# Altium schematic sheet ETH_PHY.SchDoc
size A2
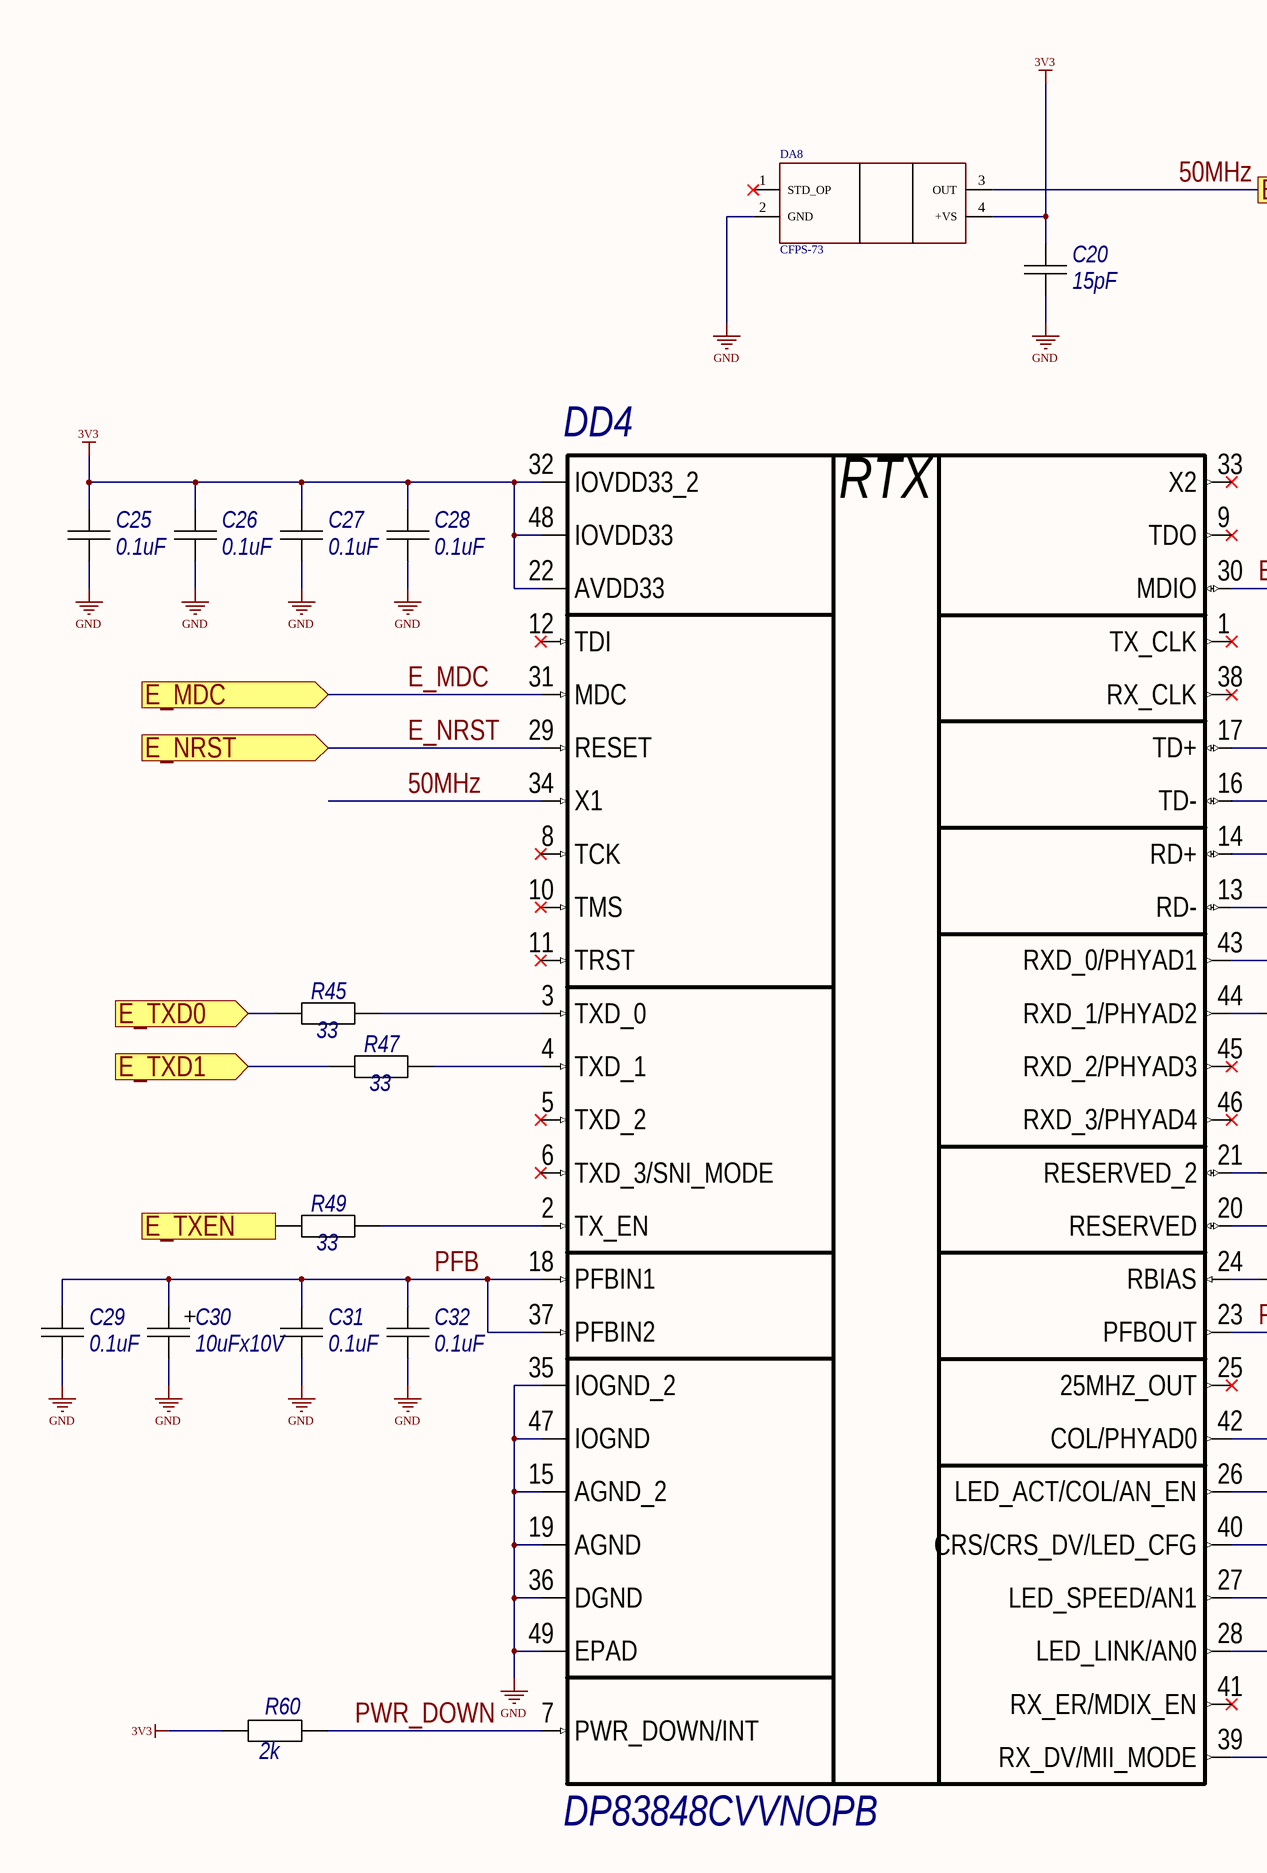
[diagram p0: ETH_PHY.SchDoc, left]
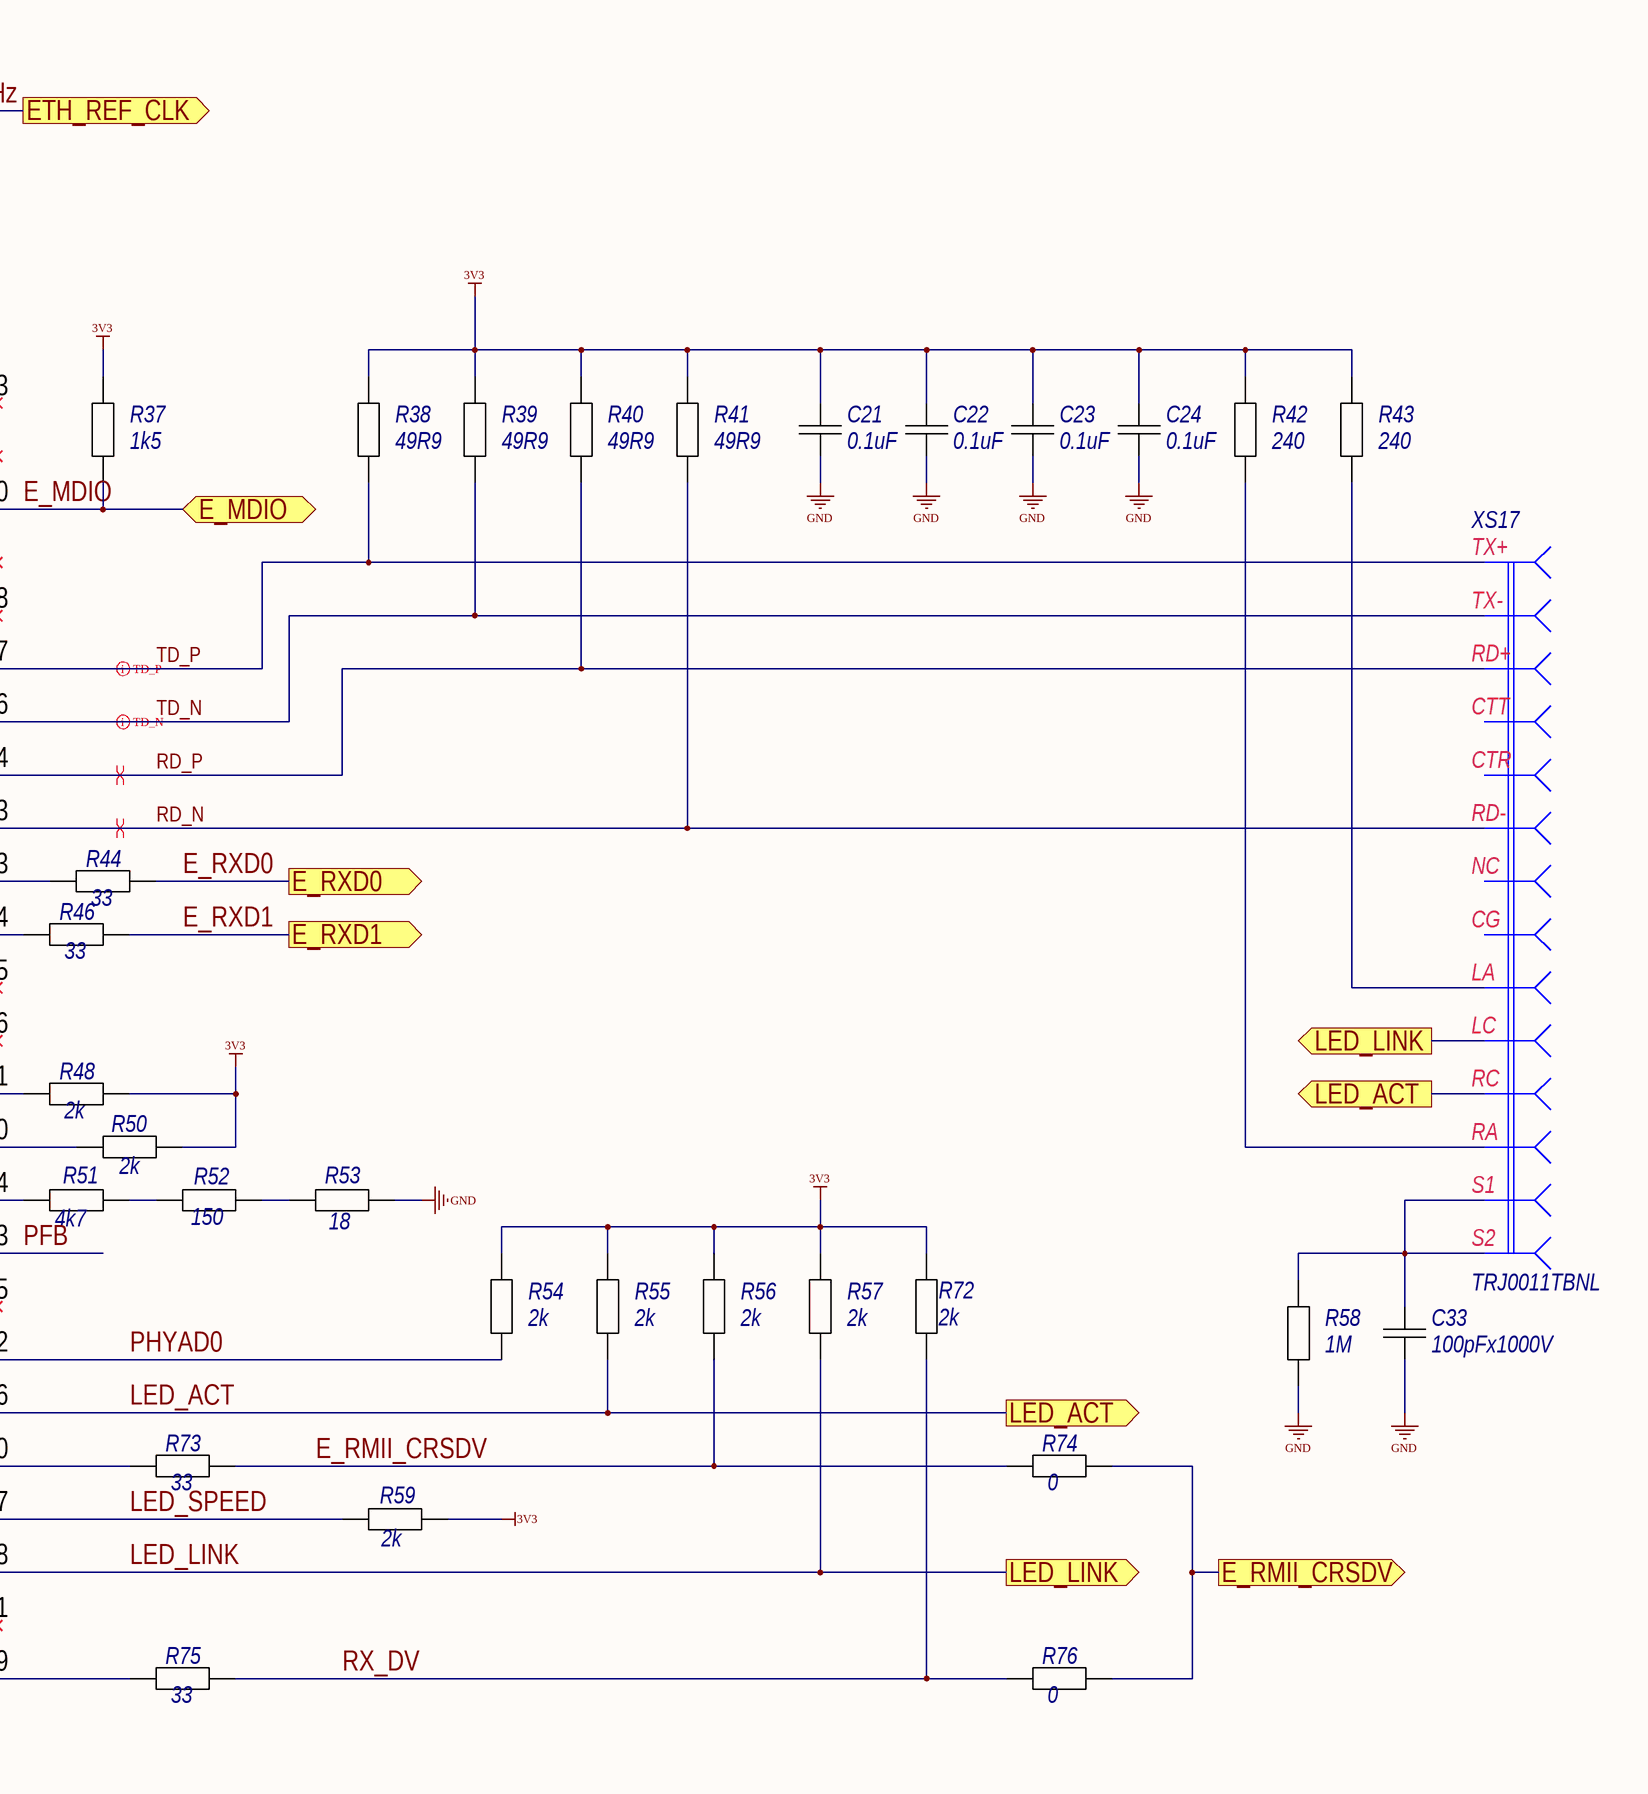
[diagram p1: ETH_PHY.SchDoc, right]

## Parts
C20  15pF  [C0805C]
C21  0.1uF  [C0805C]
C22  0.1uF  [C0805C]
C23  0.1uF  [C0805C]
C24  0.1uF  [C0805C]
C25  0.1uF  [C0805C]
C26  0.1uF  [C0805C]
C27  0.1uF  [C0805C]
C28  0.1uF  [C0805C]
C29  0.1uF  [C0805C]
C30  10uFx10V  [TECAP_A]
C31  0.1uF  [C0805C]
C32  0.1uF  [C0805C]
C33  100pFx1000V  [C0805C]
DA8  CFPS-73  [CFPS-73]
DD4  DP83848CVVNOPB  [QFP48]
R37  1k5  [C0805R]
R38  49R9  [C0805R]
R39  49R9  [C0805R]
R40  49R9  [C0805R]
R41  49R9  [C0805R]
R42  240  [C0805R]
R43  240  [C0805R]
R44  33  [C0805R]
R45  33  [C0805R]
R46  33  [C0805R]
R47  33  [C0805R]
R48  2k  [C0805R]
R49  33  [C0805R]
R50  2k  [C0805R]
R51  4k7  [C0805R]
R52  150  [C0805R]
R53  18  [C0805R]
R54  2k  [C0805R]
R55  2k  [C0805R]
R56  2k  [C0805R]
R57  2k  [C0805R]
R58  1M  [C1210R]
R59  2k  [C0805R]
R60  2k  [C0805R]
R72  2k  [C0805R]
R73  33  [C0805R]
R74  0  [C0805R]
R75  33  [C0805R]
R76  0  [C0805R]
XS17  TRJ0011TBNL  [J0011D018]

## Ports
E_MDC (in), E_MDIO (bidir), E_NRST (in), E_RMII_CRSDV (out), E_RXD0 (out), E_RXD1 (out), E_TXD0 (in), E_TXD1 (in), E_TXEN (in), ETH_REF_CLK (out), LED_ACT (out), LED_LINK (out)

## Nets
3V3: C20.2 C21.2 C22.2 C23.2 C24.2 C25.2 C26.2 C27.2 C28.2 DA8.4(+VS) DD4.22(AVDD33) DD4.32(IOVDD33_2) DD4.48(IOVDD33) R37.2 R38.2 R39.2 R40.2 R41.2 R42.2 R43.2 R48.1 R50.1 R54.2 R55.2 R56.2 R57.2 R59.2 R60.2 R72.2
GND: C20.1 C21.1 C22.1 C23.1 C24.1 C25.1 C26.1 C27.1 C28.1 C29.1 C30.2 C31.2 C32.2 C33.1 DA8.2(GND) DD4.15(AGND_2) DD4.19(AGND) DD4.35(IOGND_2) DD4.36(DGND) DD4.47(IOGND) DD4.49(EPAD) R53.1 R58.1
50MHz: DA8.3(OUT) DD4.34(X1) ; port ETH_REF_CLK
E_MDC: DD4.31(MDC) ; port E_MDC
E_MDIO: DD4.30(MDIO) R37.1 ; port E_MDIO
E_NRST: DD4.29(RESET) ; port E_NRST
E_RMII_CRSDV: R56.1 R73.1 R74.2
E_RMII_CRSDV: R74.1 R76.1 ; port E_RMII_CRSDV  [a separate net that carries the same name]
E_RXD0: R44.1 ; port E_RXD0
E_RXD1: R46.1 ; port E_RXD1
E_TXD0: R45.2 ; port E_TXD0
E_TXD1: R47.2 ; port E_TXD1
E_TXEN: R49.2 ; port E_TXEN
LED_ACT: DD4.26(LED_ACT/COL/AN_EN) R55.1 XS17.11 ; port LED_ACT
LED_LINK: DD4.28(LED_LINK/AN0) R57.1 XS17.10 ; port LED_LINK
LED_SPEED: DD4.27(LED_SPEED/AN1) R59.1
PFB: C29.2 C30.1 C31.1 C32.1 DD4.18(PFBIN1) DD4.23(PFBOUT) DD4.37(PFBIN2)
PHYAD0: DD4.42(COL/PHYAD0) R54.1
PWR_DOWN: DD4.7(PWR_DOWN/INT) R60.1
RD_N: DD4.13(RD-) R41.1 XS17.6
RD_P: DD4.14(RD+) R40.1 XS17.3
RX_DV: R72.1 R75.1 R76.2
TD_N: DD4.16(TD-) R39.1 XS17.2
TD_P: DD4.17(TD+) R38.1 XS17.1
NetC33_2: C33.2 R58.2 XS17.S1 XS17.S2
NetDD4_2: DD4.2(TX_EN) R49.1
NetDD4_3: DD4.3(TXD_0) R45.1
NetDD4_4: DD4.4(TXD_1) R47.1
NetDD4_20: DD4.20(RESERVED) R50.2
NetDD4_21: DD4.21(RESERVED_2) R48.2
NetDD4_24: DD4.24(RBIAS) R51.2
NetDD4_39: DD4.39(RX_DV/MII_MODE) R75.2
NetDD4_40: DD4.40(CRS/CRS_DV/LED_CFG) R73.2
NetDD4_43: DD4.43(RXD_0/PHYAD1) R44.2
NetDD4_44: DD4.44(RXD_1/PHYAD2) R46.2
NetR42_1: R42.1 XS17.12
NetR43_1: R43.1 XS17.9
NetR51_1: R51.1 R52.2
NetR52_1: R52.1 R53.2

Not connected (* = marked no-connect by the designer): DA8 1(STD_OP)*; DD4 1(TX_CLK)* 5(TXD_2)* 6(TXD_3/SNI_MODE)* 8(TCK)* 9(TDO)* 10(TMS)* 11(TRST)* 12(TDI)* 25(25MHZ_OUT)* 33(X2)* 38(RX_CLK)* 41(RX_ER/MDIX_EN)* 45(RXD_2/PHYAD3)* 46(RXD_3/PHYAD4)*; XS17 4 5 7 8

## Layout directives
differential pair; rule Differential Pairs Routing [Pref Gap = 0.254mm    Min Gap  = 0.203mm    Max Gap  = 0.254mmPref Width = 0.381mm    Min Width  = 0.205mm    Max Width  = 0.381mm]: TD_P
differential pair: RD_N, RD_P, TD_N

## Notes on the sheet
- (in symbol CONNECT_RJ45) TX+; TX-; RD+; CTT; CTR; RD-; NC; CG; LA; LC; RC; RA
- (in symbol DP83848) RTX

## Library data of the parts
C20-C29 C31 C32 = CAP_0805: Type: Конденсатор; Published: 18.05.2010; Publisher: Andrew Danich
C30 = CAP_TECAP_A: Type: Конденсатор; Published: 20.08.2010; Publisher: Andrew Danich
C33 = CAP_1206: Type: Конденсатор; Published: 18.05.2010; Publisher: Andrew Danich
DA8 = SPXO018044CFPS-73: IQD FREQUENCY PRODUCTS - SPXO018044-CFPS-73 - OSCILLATOR FREQUENCY, 50MHZ
DD4 = DP83848: ETH Transciever
R37-R57 R59 R60 R72-R76 = RES_0805: Published: 24.03.2010; Publisher: Andrew Danich; Type: Резистор
R58 = RES_1206: Published: 24.03.2010; Publisher: Andrew Danich; Type: Резистор
XS17 = CONNECT_RJ45: Value: Connector; Published: 07.03.2013; Publisher: Andrew Danich; Type: Розетка